# EAGLE design ATSAMD21_breakout_test (EAGLE 8.3.1)
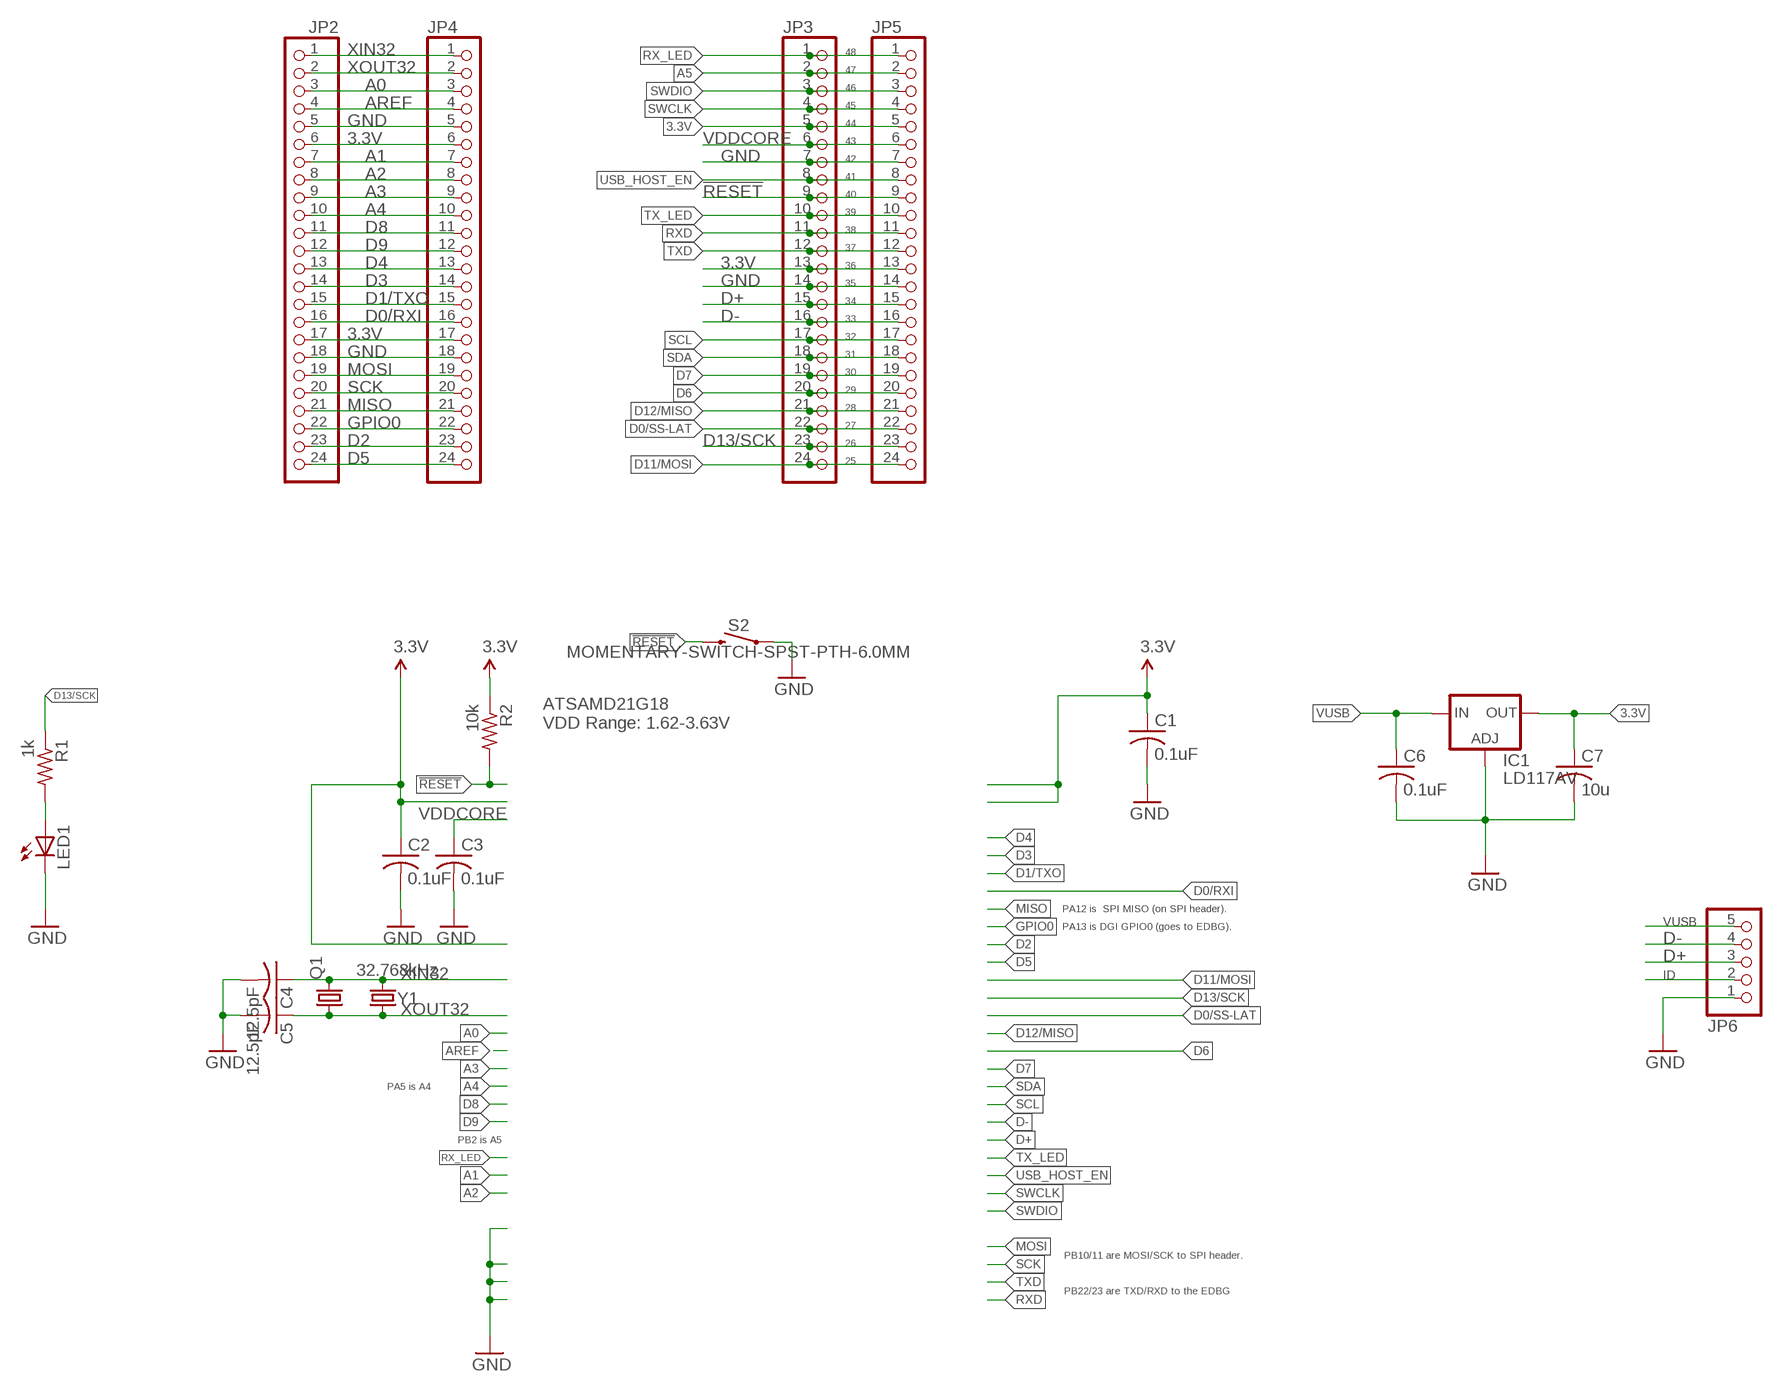
[diagram p0: schematic, sheet 1]

## Parts
C1  0.1uF  C-US025-024X044  [C025-024X044]
C2  0.1uF  C-US025-024X044  [C025-024X044]
C3  0.1uF  C-US025-024X044  [C025-024X044]
C4  12.5pF  C-US025-024X044  [C025-024X044]
C5  12.5pF  C-US025-024X044  [C025-024X044]
C6  0.1uF  C-US025-024X044  [C025-024X044]
C7  10u  C-US025-024X044  [C025-024X044]
IC1  LD117AV  [TO220L1]
JP2  PINHD-1X24  [1X24]
JP3  PINHD-1X24  [1X24]
JP4  PINHD-1X24  [1X24]
JP5  PINHD-1X24  [1X24]
JP6  PINHD-1X5  [1X05]
LED1  LED3MM  [LED3MM]
Q1  CRYSTALTC26V  [TC26V]
R1  1k  R-US_0204/7  [0204/7]
R2  10k  R-US_0204/7  [0204/7]
S2  MOMENTARY-SWITCH-SPST-PTH-6.0MM  [TACTILE_SWITCH_PTH_6.0MM]
Y1  32.768kHz  CRYSTAL3.2X1.5MM  [CRYSTAL-SMD-3.2X1.5MM]

## Nets
3.3V: C1.1 C2.1 C7.1 IC1.2(OUT) JP2.6 JP2.17 JP3.5 JP3.13 JP4.6 JP4.17 JP5.5 JP5.13 R2.1
!RESET: JP3.9 JP5.9 R2.2 S2.3
A0: JP2.3 JP4.3
A1: JP2.7 JP4.7
A2: JP2.8 JP4.8
A3: JP2.9 JP4.9
A4: JP2.10 JP4.10
A5: JP3.2 JP5.2
AREF: JP2.4 JP4.4
D0/RXI: JP2.16 JP4.16
D0/SS-LAT: JP3.22 JP5.22
D1/TXO: JP2.15 JP4.15
D2: JP2.23 JP4.23
D3: JP2.14 JP4.14
D4: JP2.13 JP4.13
D5: JP2.24 JP4.24
D6: JP3.20 JP5.20
D7: JP3.19 JP5.19
D8: JP2.11 JP4.11
D9: JP2.12 JP4.12
D11/MOSI: JP3.24 JP5.24
D12/MISO: JP3.21 JP5.21
D13/SCK: JP3.23 JP5.23 R1.1
D+: JP3.15 JP5.15 JP6.3
D-: JP3.16 JP5.16 JP6.4
GND: C1.2 C2.2 C3.2 C4.2 C5.2 C6.2 C7.2 IC1.1(ADJ) JP2.5 JP2.18 JP3.7 JP3.14 JP4.5 JP4.18 JP5.7 JP5.14 JP6.1 LED1.K(C) S2.1
GPIO0: JP2.22 JP4.22
ID: JP6.2
MISO: JP2.21 JP4.21
MOSI: JP2.19 JP4.19
N$1: LED1.A R1.2
RX_LED: JP3.1 JP5.1
RXD: JP3.11 JP5.11
SCK: JP2.20 JP4.20
SCL: JP3.17 JP5.17
SDA: JP3.18 JP5.18
SWCLK: JP3.4 JP5.4
SWDIO: JP3.3 JP5.3
TX_LED: JP3.10 JP5.10
TXD: JP3.12 JP5.12
USB_HOST_EN: JP3.8 JP5.8
VDDCORE: C3.1 JP3.6 JP5.6
VUSB: C6.1 IC1.3(IN) JP6.5
XIN32: C4.1 JP2.1 JP4.1 Q1.2 Y1.P$2
XOUT32: C5.1 JP2.2 JP4.2 Q1.1 Y1.P$1

## Notes on the sheet
- 48
- 47
- 46
- 45
- 44
- 43
- 42
- 41
- 40
- 39
- 38
- 37
- 36
- 35
- 34
- 33
- 32
- 31
- 30
- 29
- 28
- 27
- 26
- 25
- ATSAMD21G18
  VDD Range: 1.62-3.63V
- PA12 is  SPI MISO (on SPI header).
- PA13 is DGI GPIO0 (goes to EDBG).
- PA5 is A4
- PB2 is A5
- PB10/11 are MOSI/SCK to SPI header.
- PB22/23 are TXD/RXD to the EDBG

## Library data of the parts
C1-C7 = adafruit:C-US: CAPACITOR, American symbol
IC1 = v-reg:LD117A?*: Low drop fixed and adjustable positive voltage regulators 1 A Source: http://www.st.com/stonline/products/literature/ds/7194/ld1117axx.pdf
JP2-JP5 = pinhead:PINHD-1X24: PIN HEADER
JP6 = pinhead:PINHD-1X5: PIN HEADER
LED1 = adafruit:LED: LED OSRAM: - CHIPLED LG R971, LG N971, LY N971, LG Q971, LY Q971, LO R971, LY R971 LH N974, LH R974 LS Q976, LO Q976, LY Q976 LO Q996 - Hyper CHIPLED LW Q18S LB Q993, LB Q99A, LB R99A - SideLED LS A670, LO A670, LY A670, LG A670, LP A670 LB A673, LV A673, LT A673, LW A673 LH A674 LY A675 LS A676, LA A676, LO A676, LY A676, LW A676 LS A679, LY A679, LG A679 - Hyper Micro SIDELED® LS Y876, LA Y876, LO Y876, LY Y876 LT Y87S - SmartLED LW L88C, LW L88S LB L89C, LB L89S, LG L890 LS L89K, LO L89K, LY L89K LS L896, LA L896, LO L896, LY L896 - TOPLED LS T670, LO T670, LY T670, LG T670, LP T670 LSG T670, LSP T670, LSY T670, LOP T670, LYG T670 LG T671, LOG T671, LSG T671 LB T673, LV T673, LT T673, LW T673 LH T674 LS T676, LA T676, LO T676, LY T676, LB T676, LH T676, LSB T676, LW T676 LB T67C, LV T67C, LT T67C, LS T67K, LO T67K, LY T67K, LW E67C LS E67B, LA E67B, LO E67B, LY E67B, LB E67C, LV E67C, LT E67C LW T67C LS T679, LY T679, LG T679 LS T770, LO T770, LY T770, LG T770, LP T770 LB T773, LV T773, LT T773, LW T773 LH T774 LS E675, LA E675, LY E675, LS T675 LS T776, LA T776, LO T776, LY T776, LB T776 LHGB T686 LT T68C, LB T68C - Hyper Mini TOPLED® LB M676 - Mini TOPLED Santana® LG M470 LS M47K, LO M47K, LY M47K Source: http://www.osram.convergy.de/
Q1 = adafruit:CRYSTAL: CRYSTAL; OC_FARNELL: unknown; OC_NEWARK: unknown
R1 R2 = adafruit:R-US_: RESISTOR, American symbol
S2 = SparkFun-Switches:MOMENTARY-SWITCH-SPST: Momentary Switch (Pushbutton) - SPST Normally-open (NO) SPST momentary switches (buttons, pushbuttons). Variants PTH-12MM - 12mm square, through-hole Momentary Pushbutton Switch - 12mm Square <https://www.sparkfun.com/products/9190> (COM-09190) PTH-6.0MM, PTH-6.0MM-KIT - 6.0mm square, through-hole Mini Pushbutton Switch <https://www.sparkfun.com/products/97> (COM-00097) KIT package intended for soldering kit's - only one side of pads' copper is exposed. PTH-RIGHT-ANGLE-KIT - Right-angle, through-hole Right Angle Tactile Button <https://www.sparkfun.com/products/10791> - Used on SparkFun BigTime Watch Kit <https://www.sparkfun.com/products/11734> SMD-12MM - 12mm square, surface-mount Tactile Button - SMD (12mm) <https://www.sparkfun.com/products/12993> (COM-12993) Used on SparkFun PicoBoard <https://www.sparkfun.com/products/11888> SMD-4.5MM - 4.5mm Square Trackball Switch Used on SparkFun Blackberry Trackballer Breakout <https://www.sparkfun.com/products/13169> SMD-4.6MMX2.8MM - 4.60mm x 2.80mm, surface mount Used on SparkFun SAMD21 Mini Breakout <https://www.sparkfun.com/products/13664> SMD-5.2MM, SMD-5.2-REDUNDANT - 5.2mm square, surface-mount Mini Pushbutton Switch - SMD <https://www.sparkfun.com/products/8720> (COM-08720) Used on Arduino Pro Mini <https://www.sparkfun.com/products/11114> REDUNDANT package connects both switch circuits together SMD-6.0X3.5MM - 6.0 x 3.5mm, surface mount Momentary Reset Switch SMD <https://www.sparkfun.com/products/8229> (COM-08229) SMD-6.2MM-TALL - 6.2mm square, surface mount Tactile Button - SMD (6mm) <https://www.sparkfun.com/products/12992> Used on SparkFun Digital Sandbox <https://www.sparkfun.com/products/12651> SMD-RIGHT-ANGLE - Right-angle, surface mount Used on SparkFun Block for Intel® Edison - Arduino <https://www.sparkfun.com/products/13036>; PROD_ID: SWCH-08441; SF_SKU: COM-00097
Y1 = samd21-temp:CRYSTAL: Various standard crystals. Proven footprints.; PROD_ID: XTAL-13062

## Board
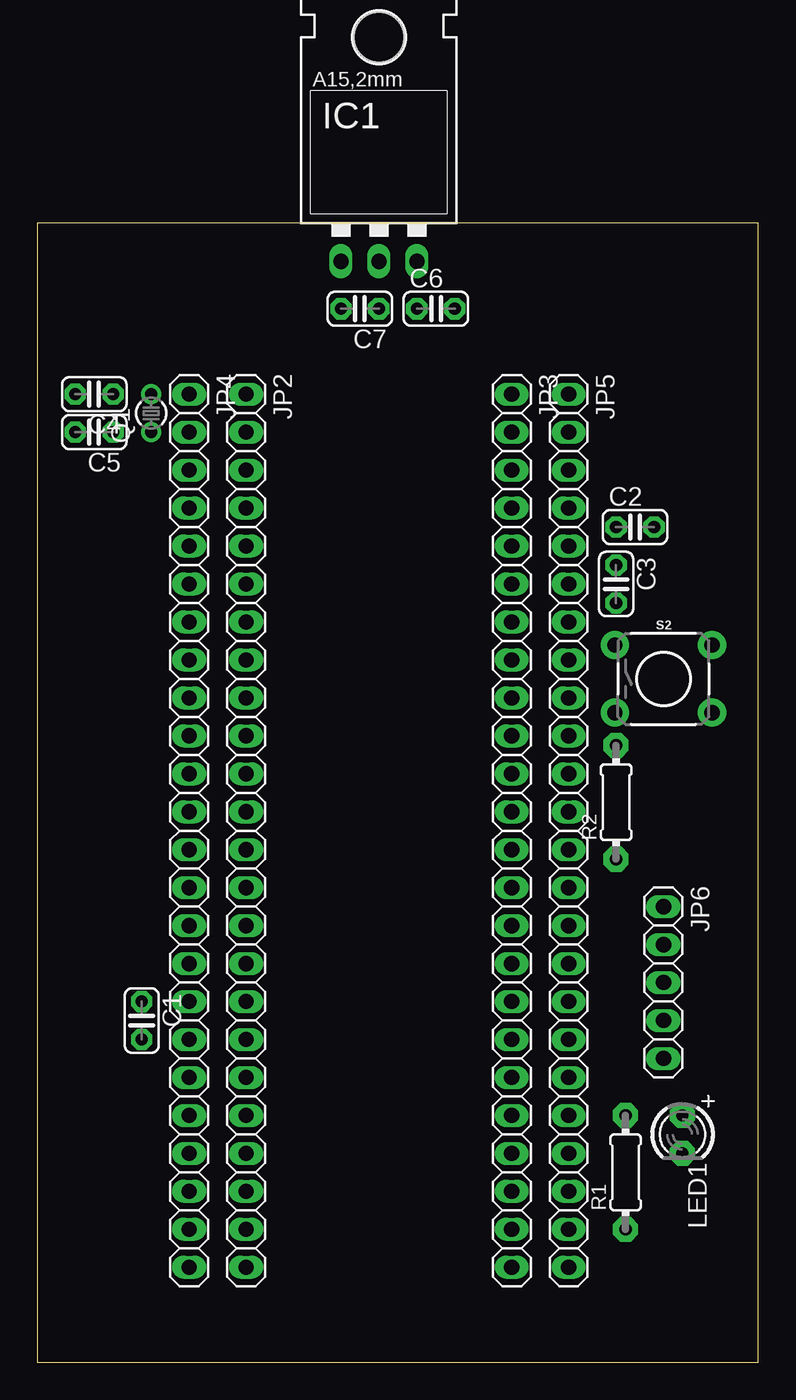
[diagram p1: board, top side]
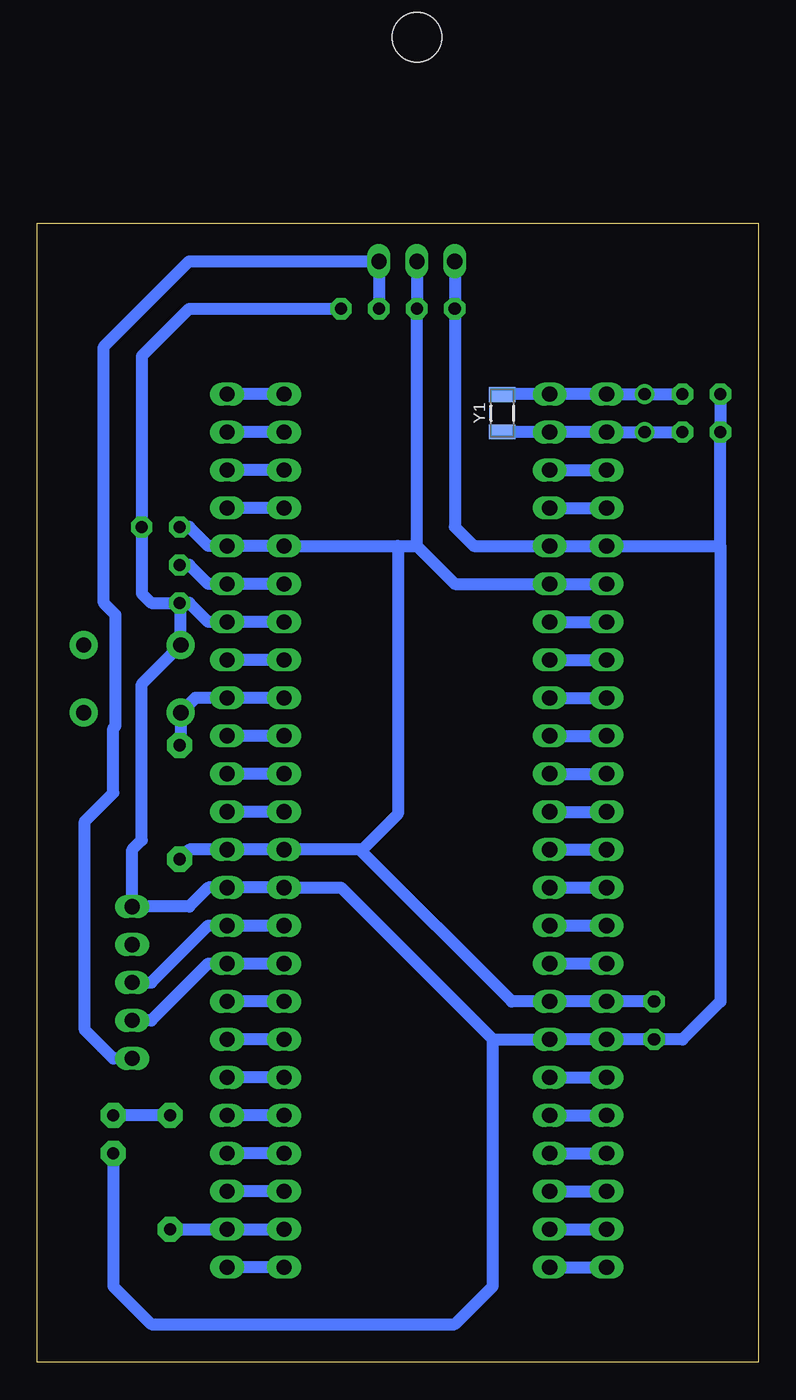
[diagram p2: board, bottom side, seen from below]

Size 48.26 x 76.2 mm. Coordinates in mm from the lower left corner, seen from the top.
Outline: 0,0 48.26,0 48.26,76.2 0,76.2 0,0
Copper layers (1*16): Top 0.035mm / dielectric 1.5mm / Bottom 0.035mm
Design rules "OthermillDRC_1_32_v2": minimum track width 8mil, minimum drill 0.8mm, track to track 0.794003125mm, track to pad 0.794003125mm, pad to pad 0.794003125mm, via to via 0.794003125mm, smd to smd 0mil, copper to edge 0mil, drill to drill 1mil, minimum pad ring 10mil, minimum via ring 10mil, stop-mask expansion 1mil, vias tented up to drill 30mil, thermal gap 10mil

### Footprints (pad centres in the part's own frame; a part is rotated, then mirrored left to right if it is on the bottom)
C025-024X044 = drill 0.813 pad 1.422 octagon: 1 -1.27,0; 2 1.27,0
TO220L1 = drill 1.016 long: 1 -2.54,-3.81; 2 0,-3.81; 3 2.54,-3.81 | hole 3.302: 0,11.176
1X24 = drill 1.016 long: 1 -29.21,0; 2 -26.67,0; 3 -24.13,0; 4 -21.59,0; 5 -19.05,0; 6 -16.51,0; 7 -13.97,0; 8 -11.43,0; 9 -8.89,0; 10 -6.35,0; 11 -3.81,0; 12 -1.27,0; 13 1.27,0; 14 3.81,0; 15 6.35,0; 16 8.89,0; 17 11.43,0; 18 13.97,0; 19 16.51,0; 20 19.05,0; 21 21.59,0; 22 24.13,0; 23 26.67,0; 24 29.21,0
1X05 = drill 1.016 long: 1 -5.08,0; 2 -2.54,0; 3 0,0; 4 2.54,0; 5 5.08,0
LED3MM = drill 0.813 pad 1.676 octagon: A -1.27,0; K 1.27,0
TC26V = drill 0.813: 1 -1.27,0; 2 1.27,0
0204/7 = drill 0.813 pad 1.676 octagon: 1 -3.81,0; 2 3.81,0
TACTILE_SWITCH_PTH_6.0MM = drill 1.016 pad 1.88: 1 -3.251,2.261; 2 3.251,2.261; 3 -3.251,-2.261; 4 3.251,-2.261
CRYSTAL-SMD-3.2X1.5MM = smd 1 x 1.8: P$1 -1.25,0; P$2 1.25,0

### Placement (x,y rotation side)
C1  6.99,22.86 270 top
C2  40.01,55.88 0 top
C3  38.73,52.07 270 top
C4  3.81,64.77 180 top
C5  3.81,62.23 180 top
C6  26.67,70.48 0 top
C7  21.59,70.48 180 top
IC1  22.86,77.47 0 top
JP2  13.97,35.56 270 top
JP3  31.75,35.56 270 top
JP4  10.16,35.56 270 top
JP5  35.56,35.56 270 top
JP6  41.91,25.4 270 top
LED1  43.18,15.24 270 top
Q1  7.62,63.5 90 top
R1  39.37,12.7 90 top
R2  38.73,37.47 90 top
S2  41.91,45.72 0 top
Y1  17.14,63.5 90 bottom

### Tracks (layer width: path | path; a pad name or v marks a point on that pad's centre or on a via)
3.3V
  Bottom 0.813: JP4.6 JP2.6 20.32,52.07 22.86,54.61 | C1.1 JP4.17 JP2.17 16.51,24.13 26.6,34.22 | IC1.2 C7.1 22.86,54.61 | 26.6,34.22 26.67,34.29 JP3.13 JP5.13 38.1,34.29 R2.1 | 24.13,54.61 JP3.5 JP5.5 36.83,54.61 38.1,55.88 C2.1 | 24.13,54.61 22.86,54.61 | 24.13,54.61 24.13,36.68 26.6,34.22
!RESET
  Bottom 0.813: JP3.9 JP5.9 37.67,44.45 S2.3 38.66,41.35 R2.2
A0
  Bottom 0.813: JP2.3 JP4.3
A1
  Bottom 0.813: JP2.7 JP4.7
A2
  Bottom 0.813: JP2.8 JP4.8
A3
  Bottom 0.813: JP2.9 JP4.9
A4
  Bottom 0.813: JP2.10 JP4.10
A5
  Bottom 0.813: JP3.2 JP5.2
AREF
  Bottom 0.813: JP2.4 JP4.4
D0/RXI
  Bottom 0.813: JP2.16 JP4.16
D0/SS-LAT
  Bottom 0.813: JP3.22 JP5.22
D1/TXO
  Bottom 0.813: JP2.15 JP4.15
D2
  Bottom 0.813: JP2.23 JP4.23
D3
  Bottom 0.813: JP2.14 JP4.14
D4
  Bottom 0.813: JP2.13 JP4.13
D5
  Bottom 0.813: JP2.24 JP4.24
D6
  Bottom 0.813: JP3.20 JP5.20
D7
  Bottom 0.813: JP3.19 JP5.19
D8
  Bottom 0.813: JP2.11 JP4.11
D9
  Bottom 0.813: JP2.12 JP4.12
D11/MOSI
  Bottom 0.813: JP3.24 JP5.24
D12/MISO
  Bottom 0.813: JP3.21 JP5.21
D13/SCK
  Bottom 0.813: JP3.23 JP5.23 R1.1
D+
  Bottom 0.813: JP3.15 JP5.15 36.83,29.21 40.64,25.4 JP6.3
D-
  Bottom 0.813: JP3.16 JP5.16 36.83,26.67 40.64,22.86 JP6.4
GND
  Bottom 0.813: C4.2 C5.2 2.54,54.59 | JP3.7 JP5.7 36.83,49.53 38.1,50.8 C3.2 | IC1.1 C7.2 20.32,55.88 19.05,54.61 JP2.5 JP4.5 2.56,54.61 2.54,54.59 | 17.78,21.59 JP2.18 JP4.18 C1.2 5.08,21.59 2.54,24.13 2.54,54.59 | 17.78,21.59 27.94,31.75 JP3.14 JP5.14 36.83,31.75 38.1,30.48 JP6.1 41.91,34.29 41.27,34.92 41.27,45.36 S2.1 38.66,50.72 C3.2 | C6.2 38.1,70.48 41.27,67.31 C2.2 41.27,51.44 40.64,50.8 C3.2 | LED1.K 43.18,5.08 40.64,2.54 20.32,2.54 17.78,5.08 17.78,21.59
GPIO0
  Bottom 0.813: JP2.22 JP4.22
MISO
  Bottom 0.813: JP2.21 JP4.21
MOSI
  Bottom 0.813: JP2.19 JP4.19
N$1
  Bottom 0.813: R1.2 LED1.A
RX_LED
  Bottom 0.813: JP3.1 JP5.1
RXD
  Bottom 0.813: JP3.11 JP5.11
SCK
  Bottom 0.813: JP2.20 JP4.20
SCL
  Bottom 0.813: JP3.17 JP5.17
SDA
  Bottom 0.813: JP3.18 JP5.18
SWCLK
  Bottom 0.813: JP3.4 JP5.4
SWDIO
  Bottom 0.813: JP3.3 JP5.3
TX_LED
  Bottom 0.813: JP3.10 JP5.10
TXD
  Bottom 0.813: JP3.12 JP5.12
USB_HOST_EN
  Bottom 0.813: JP3.8 JP5.8
VDDCORE
  Bottom 0.813: JP3.6 JP5.6 36.83,52.07 38.1,53.34 C3.1
VUSB
  Bottom 0.813: C6.1 IC1.3 38.1,73.66 43.81,67.94 43.81,50.8 43.02,50.01 43.02,42.57 43.18,42.41 43.18,38.1 45.09,36.2 45.09,22.23 43.18,20.32 JP6.5
XIN32
  Bottom 0.813: C4.1 Q1.2 JP4.1 JP2.1 16.49,64.77 Y1.P$2
XOUT32
  Bottom 0.813: C5.1 Q1.1 JP4.2 JP2.2 16.49,62.23 Y1.P$1